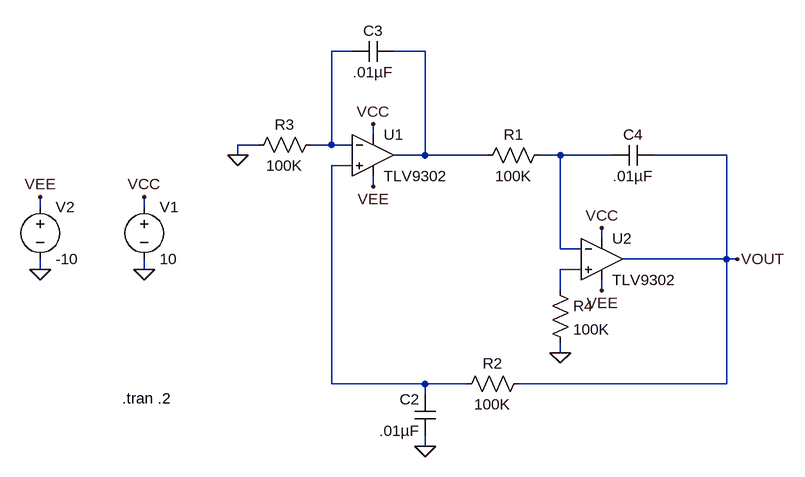
[diagram p0: schematic Quadrature_Oscillator.asc]
Quadrature_Oscillator.asc, the LTspice schematic file:
Version 4
SHEET 1 880 680
WIRE 64 -48 32 -48
WIRE 176 -48 128 -48
WIRE 96 80 96 64
WIRE -80 96 -112 96
WIRE 32 96 32 -48
WIRE 32 96 0 96
WIRE 64 96 32 96
WIRE -112 112 -112 96
WIRE 176 112 176 -48
WIRE 176 112 128 112
WIRE 272 112 176 112
WIRE 384 112 352 112
WIRE 464 112 384 112
WIRE 640 112 528 112
WIRE 64 128 32 128
WIRE 96 160 96 144
WIRE -416 192 -416 176
WIRE -256 192 -256 176
WIRE 448 240 448 224
WIRE 384 256 384 112
WIRE 416 256 384 256
WIRE 640 272 640 112
WIRE 640 272 480 272
WIRE 656 272 640 272
WIRE -416 288 -416 272
WIRE -256 288 -256 272
WIRE 416 288 384 288
WIRE 384 320 384 288
WIRE 448 320 448 304
WIRE 384 416 384 400
WIRE 32 464 32 128
WIRE 176 464 32 464
WIRE 240 464 176 464
WIRE 640 464 640 272
WIRE 640 464 320 464
WIRE 176 480 176 464
WIRE 176 560 176 544
FLAG 96 64 VCC
FLAG 448 224 VCC
FLAG -256 288 0
FLAG -256 176 VCC
FLAG 384 416 0
FLAG 176 560 0
FLAG -112 112 0
FLAG 656 272 VOUT
FLAG -416 288 0
FLAG -416 176 VEE
FLAG 96 160 VEE
FLAG 448 320 VEE
SYMBOL Hab_OpAmp\\TLV9302 96 48 R0
SYMATTR InstName U1
SYMBOL Hab_OpAmp\\TLV9302 448 208 R0
SYMATTR InstName U2
SYMBOL voltage -256 176 R0
WINDOW 123 0 0 Left 0
WINDOW 39 0 0 Left 0
SYMATTR InstName V1
SYMATTR Value 10
SYMBOL cap 192 544 R180
WINDOW 0 24 56 Left 2
WINDOW 3 24 8 Left 2
SYMATTR InstName C2
SYMATTR Value .01µF
SYMBOL res 336 448 R90
WINDOW 0 0 56 VBottom 2
WINDOW 3 32 56 VTop 2
SYMATTR InstName R2
SYMATTR Value 100K
SYMBOL res 16 80 R90
WINDOW 0 0 56 VBottom 2
WINDOW 3 32 56 VTop 2
SYMATTR InstName R3
SYMATTR Value 100K
SYMBOL cap 128 -64 R90
WINDOW 0 0 32 VBottom 2
WINDOW 3 32 32 VTop 2
SYMATTR InstName C3
SYMATTR Value .01µF
SYMBOL cap 528 96 R90
WINDOW 0 0 32 VBottom 2
WINDOW 3 32 32 VTop 2
SYMATTR InstName C4
SYMATTR Value .01µF
SYMBOL res 368 96 R90
WINDOW 0 0 56 VBottom 2
WINDOW 3 32 56 VTop 2
SYMATTR InstName R1
SYMATTR Value 100K
SYMBOL res 368 304 R0
SYMATTR InstName R4
SYMATTR Value 100K
SYMBOL voltage -416 176 R0
WINDOW 123 0 0 Left 0
WINDOW 39 0 0 Left 0
SYMATTR InstName V2
SYMATTR Value -10
TEXT -290 486 Left 2 !.tran .2

The netlist it stands for:
* Quadrature_Oscillator.asc
* U1: TLV9302 (symbol Hab_OpAmp\TLV9302 not available, pins judged from their places): In+=N004 In-=N001 V+=VCC V-=VEE OUT=N002
* U2: TLV9302 (symbol Hab_OpAmp\TLV9302 not available, pins judged from their places): In+=N005 In-=N003 V+=VCC V-=VEE OUT=VOUT
V1 VCC 0 10
C2 0 N004 .01µF
R2 VOUT N004 100K
R3 N001 0 100K
C3 N002 N001 .01µF
C4 VOUT N003 .01µF
R1 N003 N002 100K
R4 N005 0 100K
V2 VEE 0 -10
.tran .2
.backanno
.end